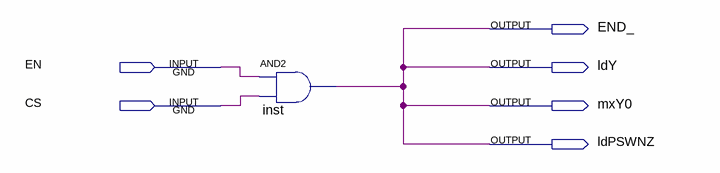
[diagram p0: schematic sheet]
// Quartus schematic TAY.bdf as structural Verilog: 1 symbols, 6 pins
module TAY (
  input  EN,
  input  CS,
  output END_,
  output ldY,
  output mxY0,
  output ldPSWNZ
);

  and inst (END_, EN, CS);

  assign ldPSWNZ = END_;
  assign ldY = END_;
  assign mxY0 = END_;
endmodule
